# EAGLE schematic Arduino101 (EAGLE 7.7.0)

## Sheet 1 of 5: COVER PAGE -Table Of Contents
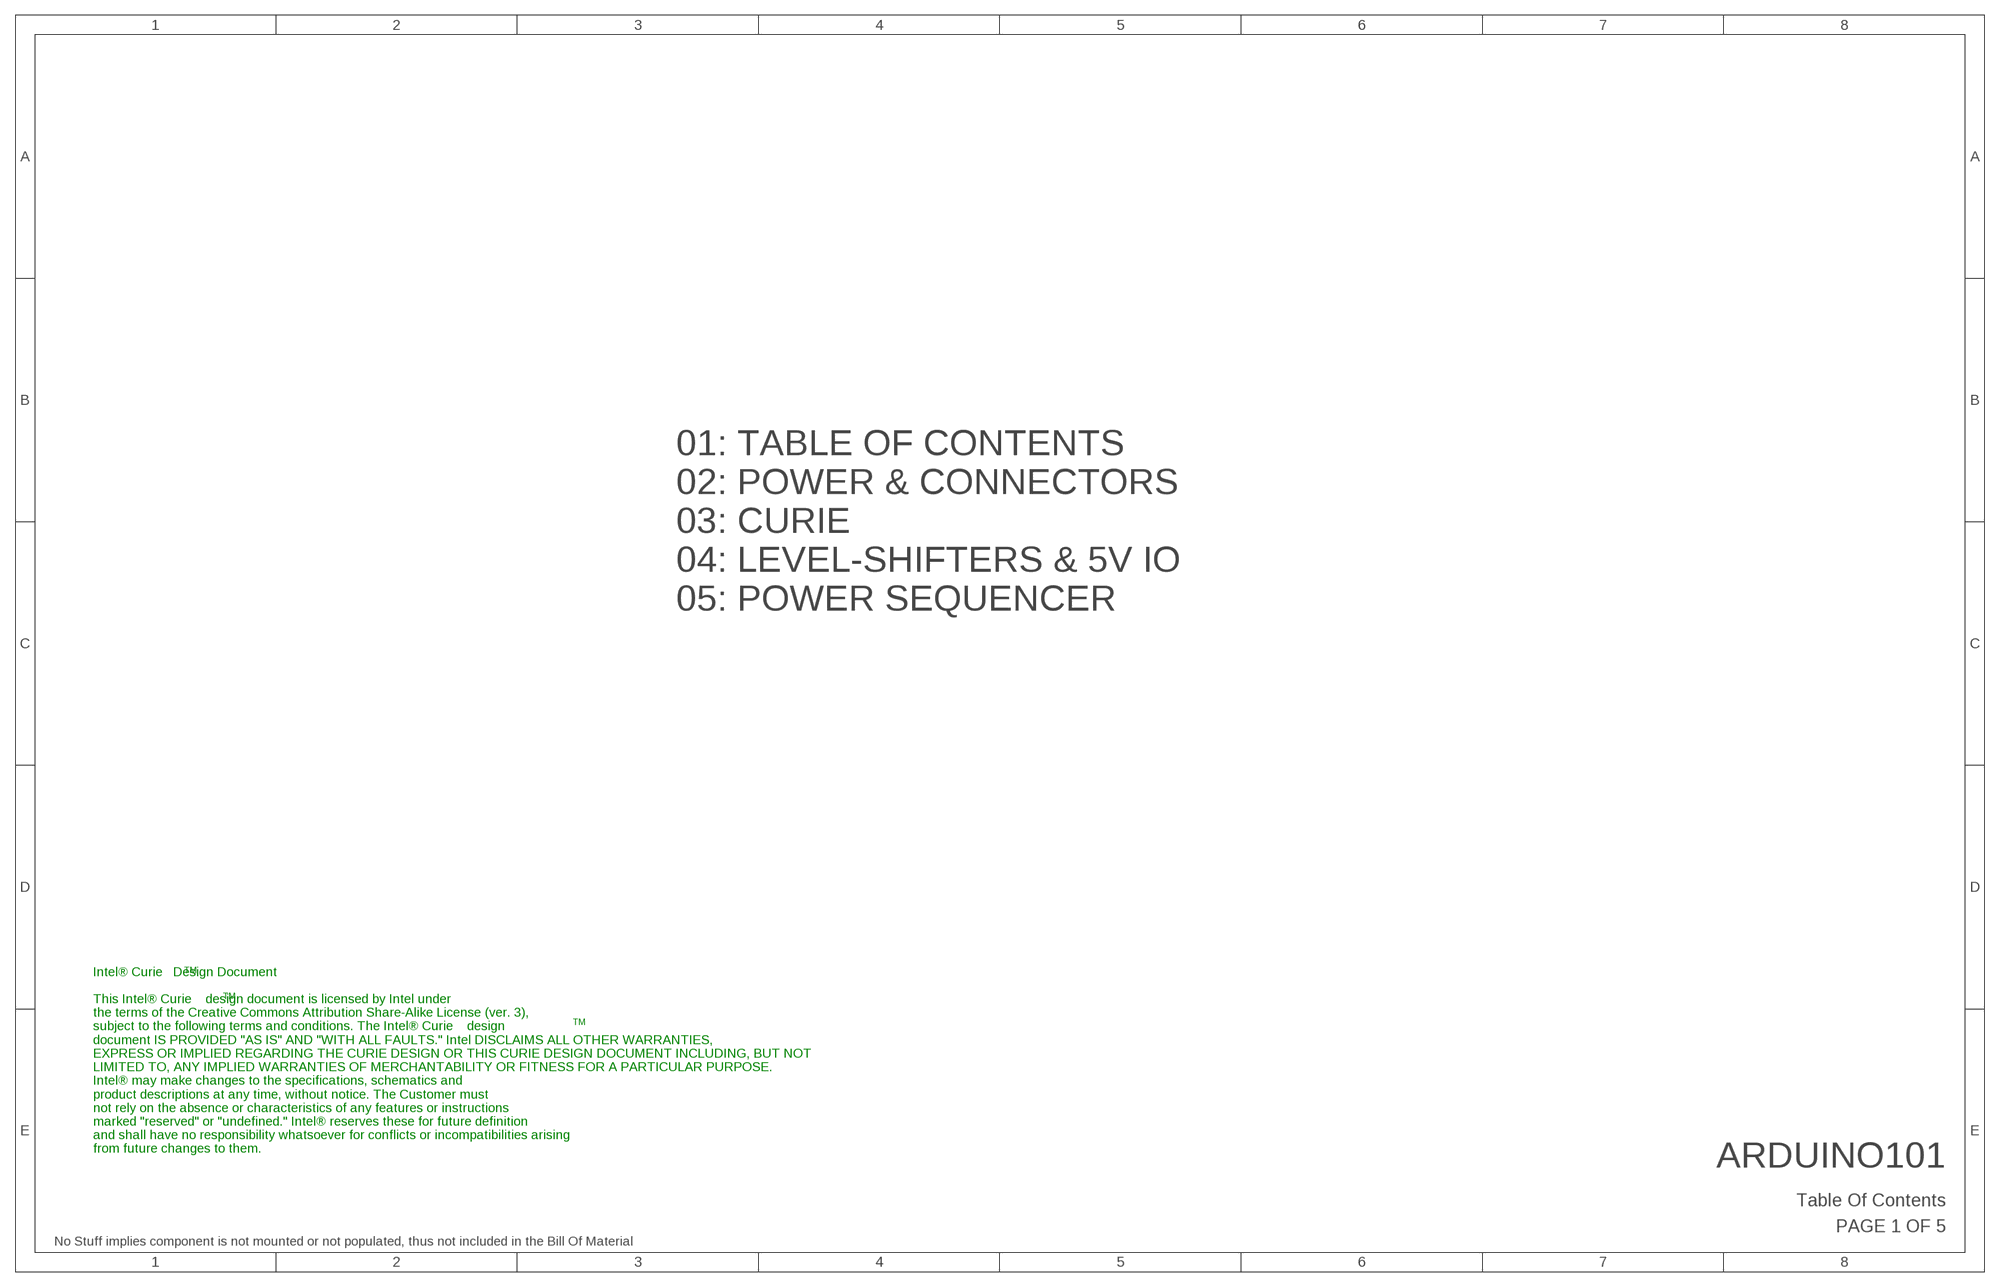
[diagram p0: schematic, sheet 1]

### Notes on the sheet
- 01: TABLE OF CONTENTS
- 02: POWER & CONNECTORS
- 03: CURIE
- 04: LEVEL-SHIFTERS & 5V IO
- 05: POWER SEQUENCER
- TM
- TM
- TM
- ARDUINO101
- Intel® Curie   Design Document
  
  This Intel® Curie    design document is licensed by Intel under
  the terms of the Creative Commons Attribution Share-Alike License (ver. 3),
  subject to the following terms and conditions. The Intel® Curie    design 
  document IS PROVIDED "AS IS" AND "WITH ALL FAULTS." Intel DISCLAIMS ALL OTHER WARRANTIES, 
  EXPRESS OR IMPLIED REGARDING THE CURIE DESIGN OR THIS CURIE DESIGN DOCUMENT INCLUDING, BUT NOT 
  LIMITED TO, ANY IMPLIED WARRANTIES OF MERCHANTABILITY OR FITNESS FOR A PARTICULAR PURPOSE.
  Intel® may make changes to the specifications, schematics and 
  product descriptions at any time, without notice. The Customer must 
  not rely on the absence or characteristics of any features or instructions 
  marked "reserved" or "undefined." Intel® reserves these for future definition 
  and shall have no responsibility whatsoever for conflicts or incompatibilities arising 
  from future changes to them.
- Table Of Contents
- PAGE 1 OF 5
- No Stuff implies component is not mounted or not populated, thus not included in the Bill Of Material

## Sheet 2 of 5: POWER & CONNECTORS
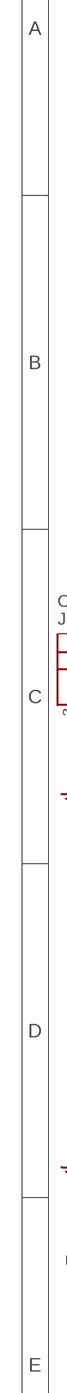
[diagram p1: schematic, sheet 2, part 1 of 2]
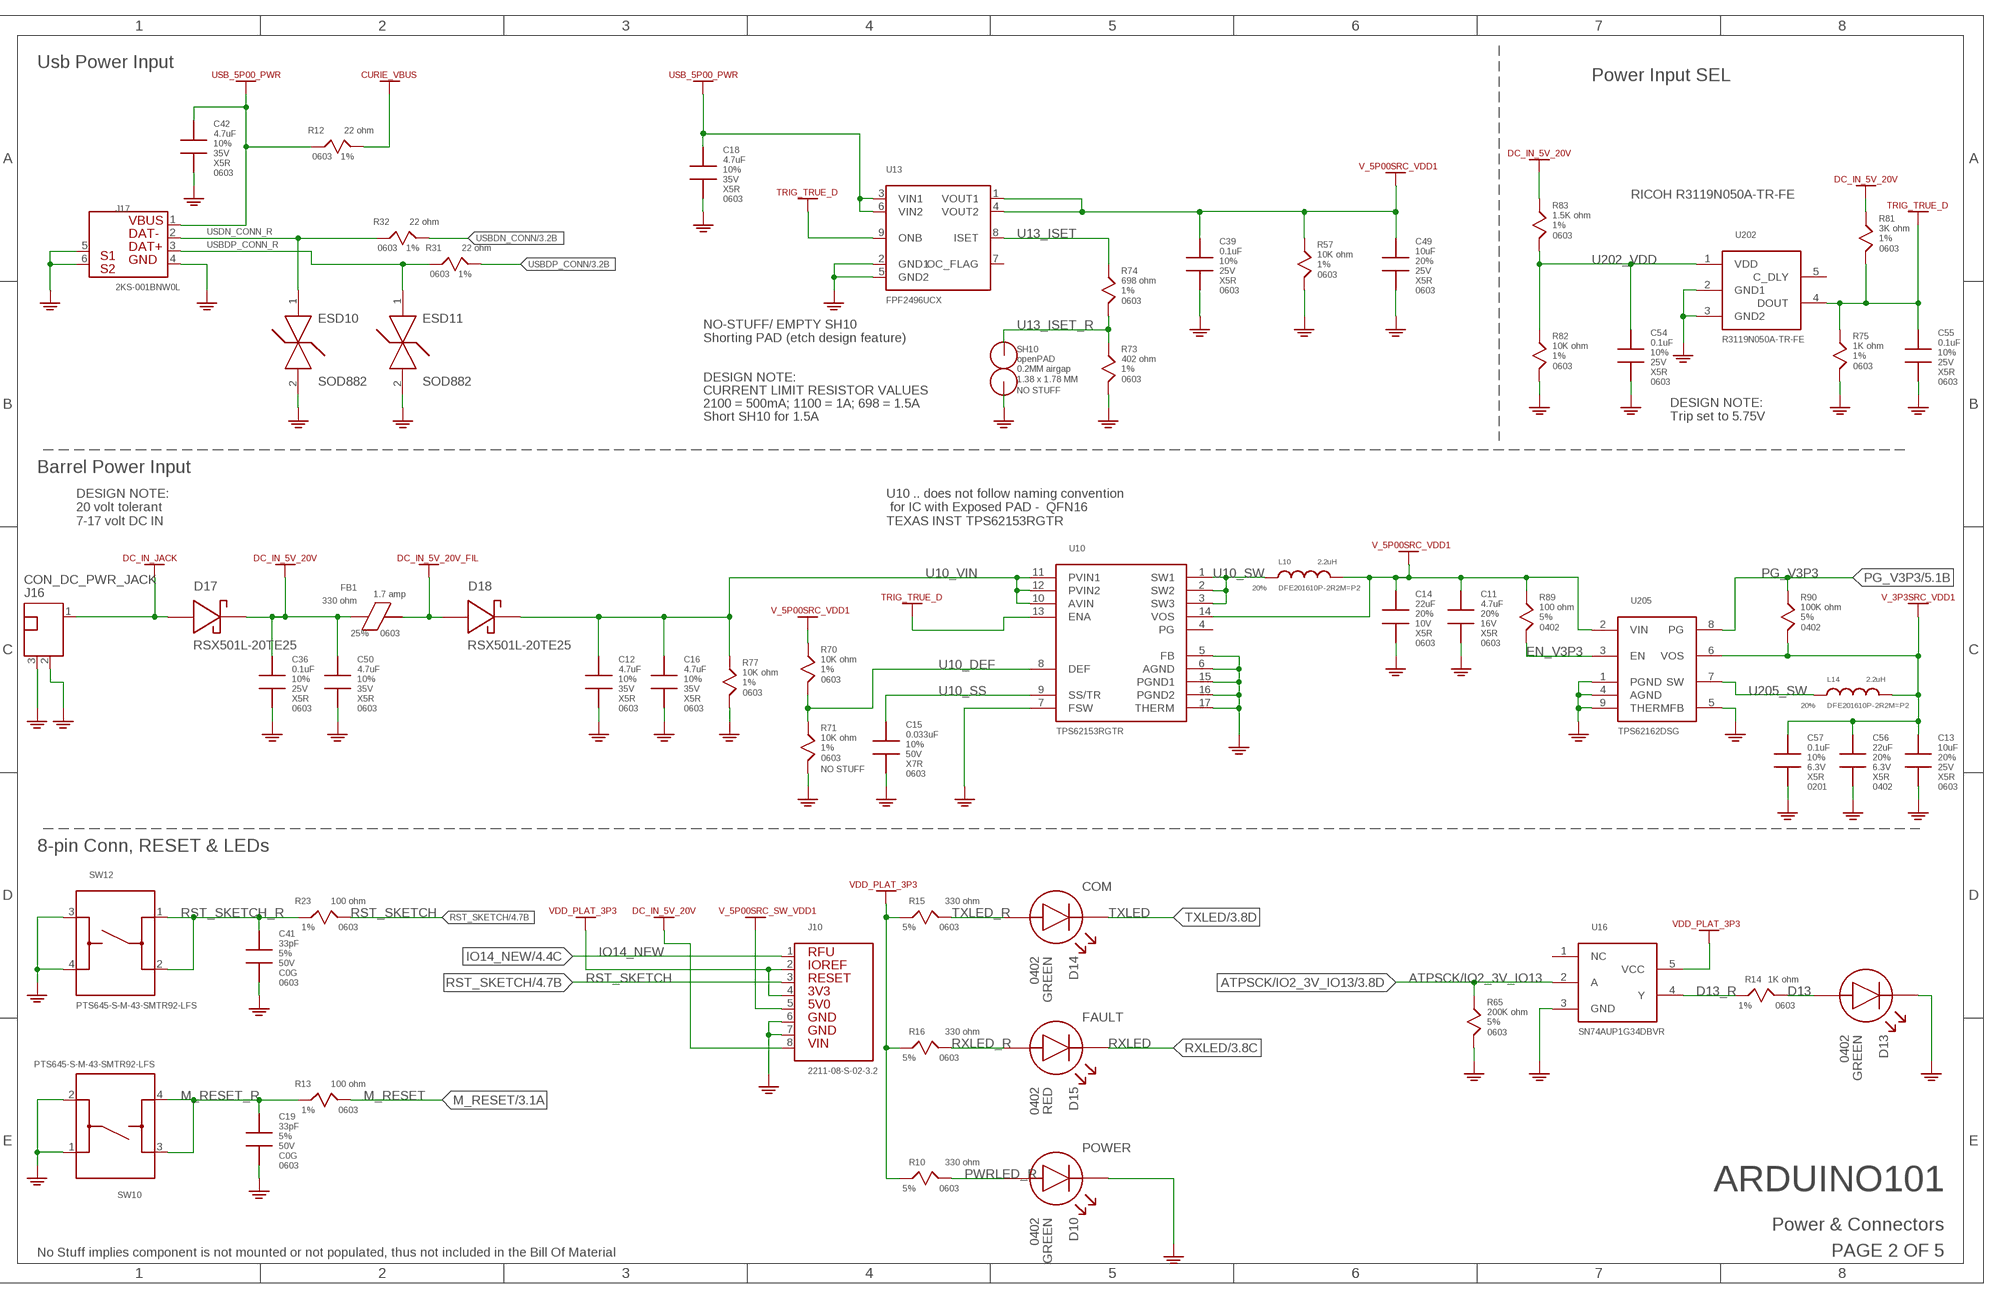
[diagram p2: schematic, sheet 2, part 2 of 2]

### Parts
C11  4.7uF  GRM188R61C475KAAJD  [0603X90H]
C12  4.7uF  GRM188R6YA475KE15D  [0603X90H]
C13  10uF  GRM188R61E106MA73D  [0603X90H]
C14  22uF  GRM188R61A226ME15D  [0603X90H]
C15  0.033uF  GRM188R71H333KA61F  [0603X90H]
C16  4.7uF  GRM188R6YA475KE15D  [0603X90H]
C18  4.7uF  GRM188R6YA475KE15D  [0603X90H]
C19  33pF  GRM1885C1H330JA01F  [0603X90H]
C36  0.1uF  GRM188R61E104KA01  [0603X90H]
C39  0.1uF  GRM188R61E104KA01  [0603X90H]
C41  33pF  GRM1885C1H330JA01F  [0603X90H]
C42  4.7uF  GRM188R6YA475KE15D  [0603X90H]
C49  10uF  GRM188R61E106MA73D  [0603X90H]
C50  4.7uF  GRM188R6YA475KE15D  [0603X90H]
C54  0.1uF  GRM188R61E104KA01  [0603X90H]
C55  0.1uF  GRM188R61E104KA01  [0603X90H]
C56  22uF  GRM155R60J226ME11D  [CAP0402]
C57  0.1uF  GRM033R60J104KE81D  [CAP0201]
D10  LED_SML-P12PTT86  [LED_100X60X25H_SMLP13]
D13  LED_SML-P12PTT86  [LED_100X60X25H_SMLP13]
D14  LED_SML-P12PTT86  [LED_100X60X25H_SMLP13]
D15  LED_SML-P11UTT86  [LED_100X60X25H_SMLP13]
D17  DIO_RSX501L-20TE25  [DIO2_450X260X220H]
D18  DIO_RSX501L-20TE25  [DIO2_450X260X220H]
ESD10  PESD5V0X1BCAL,315  [DIO_SOD882]
ESD11  PESD5V0X1BCAL,315  [DIO_SOD882]
FB1  FERRITE_BEAD_0603_BLM18KG331SN1D  [0603X90H]
J10  CON_1X8_2211-08-S-02-3.2  [CONF1X8-254P_2104X240X850H_TH]
J16  CON_DC_PWR_JACK  [CON_JACK_880X1350X1135H_EJ508A]
J17  CON_USB_TYPE_B  [CON_USB_1204X1650X1115_AUY1007]
L10  2.2uH  IND_DFE201610P-2R2M=P2  [0806X100H]
L14  2.2uH  IND_DFE201610P-2R2M=P2  [0806X100H]
R10  330 ohm  RK73B1JTTD331J  [0603X90H]
R12  22 ohm  CRCW060322R0FKEA  [0603X90H]
R13  100 ohm  RK73H1JTTD1000F  [0603X90H]
R14  1K ohm  RK73H1JTTD1001F  [0603X90H]
R15  330 ohm  RK73B1JTTD331J  [0603X90H]
R16  330 ohm  RK73B1JTTD331J  [0603X90H]
R23  100 ohm  RK73H1JTTD1000F  [0603X90H]
R31  22 ohm  CRCW060322R0FKEA  [0603X90H]
R32  22 ohm  CRCW060322R0FKEA  [0603X90H]
R57  10K ohm  CRCW060310K0FKEA  [0603X90H]
R65  200K ohm  CRCW0603200KJNEB  [0603X90H]
R70  10K ohm  CRCW060310K0FKEA  [0603X90H]
R71  10K ohm  CRCW060310K0FKEA_NOSTUFF  [0603X90H]
R73  402 ohm  CRCW0603402RFKEB  [0603X90H]
R74  698 ohm  CRCW0603698RFKEB  [0603X90H]
R75  1K ohm  RK73H1JTTD1001F  [0603X90H]
R77  10K ohm  CRCW060310K0FKEA  [0603X90H]
R81  3K ohm  RK73H1JTTD3001F  [0603X90H]
R82  10K ohm  CRCW060310K0FKEA  [0603X90H]
R83  1.5K ohm  CRCW06031K50FKEB  [0603X90H]
R89  100 ohm  CRCW0402100RJNED  [SMR0402]
R90  100K ohm  RK73B1ETTP104J  [SMR0402]
SH10  openPAD  SHORTING_PAD_2_SHORT_140X180_SH  [SHORT_140X180]
SW10  SWITCH_PTS645-S-M-43-SMTR92-LFS  [SW4_600X600X430H_SM_PTS645]
SW12  SWITCH_PTS645-S-M-43-SMTR92-LFS  [SW4_600X600X430H_SM_PTS645]
U10  TPS62153RGTR  [QFN16-50P_300X300X100H_TR]
U13  FPF2496UCX_WLCSP_VREG  [BGA9_3X3-40P_121X121X63H]
U16  SN74AUP1G34DBVR  [SOT23-5_160X290X145H]
U202  R3119-VREG  [SOT23-5_160X290X120H]
U205  TPS62162DSG  [USON8_5MM_2X2MM-DIE]

### Nets
ATPSCK/IO2_3V_IO13: R65.1 U16.2(A) ; also sheet 3,4
CURIE_VBUS: R12.2 ; also sheet 3
D13: D13.1(A) R14.2
D13_R: R14.1 U16.4(Y)
DC_IN_5V_20V: C36.1 C50.1 D17.1 FB1.1 J10.8 R81.1 R83.1
DC_IN_5V_20V_FIL: D18.2 FB1.2
DC_IN_JACK: D17.2 J16.1 ; also sheet 5
EN_V3P3 [PWR]: R89.2 U205.3(EN)
GND [PWR]: C11.2 C12.2 C13.2 C14.2 C15.2 C16.2 C18.2 C19.2 C36.2 C39.2 C41.2 C42.2 C49.2 C50.2 C54.2 C55.2 C56.2 C57.2 D10.2(K) D13.2(K) ESD10.2 ESD11.2 J10.6 J10.7 J16.2 J16.3 J17.4 J17.5 J17.6 R57.2 R65.2 R71.2 R73.2 R75.2 R77.2 R82.2 SH10.2 SW10.1 SW10.2 SW12.3 SW12.4 U10.5(FB) U10.6(AGND) U10.7(FSW) U10.15(PGND1) U10.16(PGND2) U10.17(THERM) U13.2(GND1) U13.5(GND2) U16.3(GND) U202.2(GND1) U202.3(GND2) U205.1(PGND) U205.4(AGND) U205.5(FB) U205.9(THERM) ; also sheet 3,4,5
IO14_NEW: J10.1 ; also sheet 4
M_RESET: R13.2 ; also sheet 3
M_RESET_R: C19.1 R13.1 SW10.3 SW10.4
PG_V3P3: R90.1 U205.8(PG) ; also sheet 5
PWRLED_R: D10.1(A) R10.2
RST_SKETCH: J10.3 R23.2 ; also sheet 4
RST_SKETCH_R: C41.1 R23.1 SW12.1 SW12.2
RXLED: D15.2(K) ; also sheet 3
RXLED_R: D15.1(A) R16.2
TRIG_TRUE_D: C55.1 R75.1 R81.2 U10.13(ENA) U13.9(ONB) U202.4(DOUT)
TXLED: D14.2(K) ; also sheet 3
TXLED_R: D14.1(A) R15.2
U10_DEF: R70.2 R71.1 U10.8(DEF)
U10_SS: C15.1 U10.9(SS/TR)
U10_SW: L10.1 U10.1(SW1) U10.2(SW2) U10.3(SW3)
U10_VIN: C12.1 C16.1 D18.1 R77.1 U10.10(AVIN) U10.11(PVIN1) U10.12(PVIN2)
U13_ISET: R74.1 U13.8(ISET)
U13_ISET_R: R73.1 R74.2 SH10.1
U202_VDD: C54.1 R82.1 R83.2 U202.1(VDD)
U205_SW: L14.1 U205.7(SW)
USB_5P00_PWR [PWR]: C18.1 C42.1 J17.1 R12.1 U13.3(VIN1) U13.6(VIN2) ; also sheet 5
USBDN_CONN [DIFF100]: R32.2 ; also sheet 3,5
USBDP_CONN: R31.2 ; also sheet 3,5
USBDP_CONN_R [DIFF100]: ESD11.1 J17.3 R31.1
USDN_CONN_R [DIFF100]: ESD10.1 J17.2 R32.1
V_3P3SRC_VDD1 [PWR]: C13.1 C56.1 C57.1 L14.2 R90.2 U205.6(VOS) ; also sheet 5
V_5P00SRC_SW_VDD1: J10.5 ; also sheet 4,5
V_5P00SRC_VDD1 [PWR]: C11.1 C14.1 C39.1 C49.1 L10.2 R57.1 R70.1 R89.1 U10.14(VOS) U13.1(VOUT1) U13.4(VOUT2) U205.2(VIN) ; also sheet 5
VDD_PLAT_3P3 [PWR]: J10.2 J10.4 R10.1 R15.1 R16.1 U16.5(VCC) ; also sheet 3,4,5
Unconnected: U10.4(PG) U13.7(OC_FLAG) U16.1(NC) U202.5(C_DLY)

### Notes on the sheet
- Usb Power Input
- Power Input SEL
- RICOH R3119N050A-TR-FE
- NO-STUFF/ EMPTY SH10
  Shorting PAD (etch design feature)
- DESIGN NOTE:
- CURRENT LIMIT RESISTOR VALUES
- 2100 = 500mA; 1100 = 1A; 698 = 1.5A
- Short SH10 for 1.5A
- DESIGN NOTE:
  Trip set to 5.75V
- Barrel Power Input
- DESIGN NOTE:
  20 volt tolerant
  7-17 volt DC IN
- U10 .. does not follow naming convention
   for IC with Exposed PAD -  QFN16 
  TEXAS INST TPS62153RGTR
- 8-pin Conn, RESET & LEDs
- COM
- FAULT
- POWER
- ARDUINO101
- Power & Connectors
- PAGE 2 OF 5
- No Stuff implies component is not mounted or not populated, thus not included in the Bill Of Material

## Sheet 3 of 5: Curie
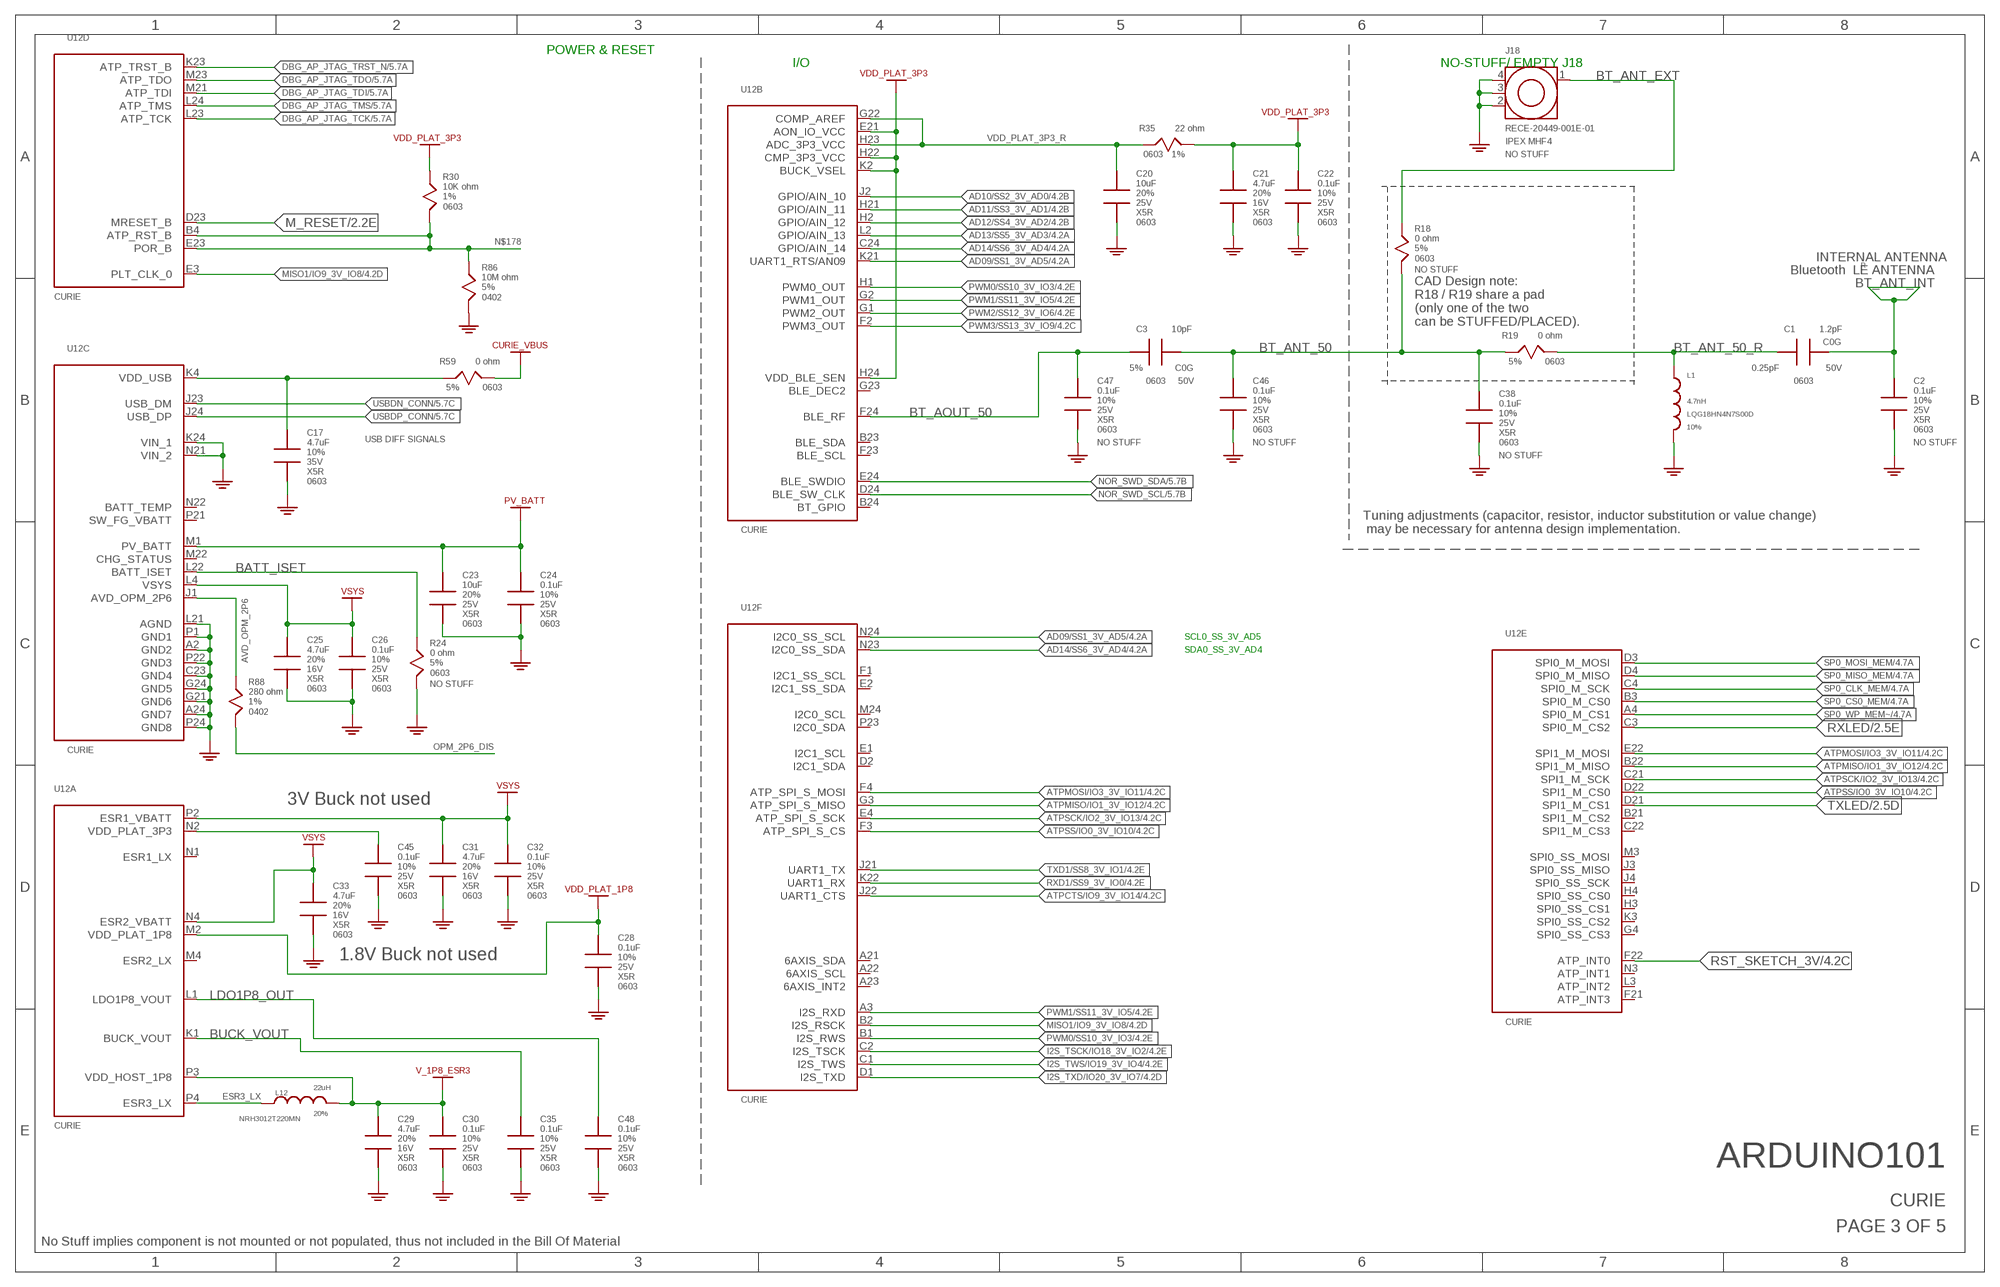
[diagram p3: schematic, sheet 3]

### Parts
C1  1.2pF  CC0603CRNPO9BN1R2  [0603X90H]
C2  0.1uF  GRM188R61E104KA01_NOSTUFF  [0603X90H]
C3  10pF  GRM1885C1H100JA01F  [0603X90H]
C17  4.7uF  GRM188R6YA475KE15D  [0603X90H]
C20  10uF  GRM188R61E106MA73D  [0603X90H]
C21  4.7uF  GRM188R61C475KAAJD  [0603X90H]
C22  0.1uF  GRM188R61E104KA01  [0603X90H]
C23  10uF  GRM188R61E106MA73D  [0603X90H]
C24  0.1uF  GRM188R61E104KA01  [0603X90H]
C25  4.7uF  GRM188R61C475KAAJD  [0603X90H]
C26  0.1uF  GRM188R61E104KA01  [0603X90H]
C28  0.1uF  GRM188R61E104KA01  [0603X90H]
C29  4.7uF  GRM188R61C475KAAJD  [0603X90H]
C30  0.1uF  GRM188R61E104KA01  [0603X90H]
C31  4.7uF  GRM188R61C475KAAJD  [0603X90H]
C32  0.1uF  GRM188R61E104KA01  [0603X90H]
C33  4.7uF  GRM188R61C475KAAJD  [0603X90H]
C35  0.1uF  GRM188R61E104KA01  [0603X90H]
C38  0.1uF  GRM188R61E104KA01_NOSTUFF  [0603X90H]
C45  0.1uF  GRM188R61E104KA01  [0603X90H]
C46  0.1uF  GRM188R61E104KA01_NOSTUFF  [0603X90H]
C47  0.1uF  GRM188R61E104KA01_NOSTUFF  [0603X90H]
C48  0.1uF  GRM188R61E104KA01  [0603X90H]
J18  20449-001E-01  [CONN_COAX_MHF4]
L1  4.7nH  IND_LQG18HN4N7S00D  [0603X90H]
L12  22uH  NRH3012T220MN  [COIL_300X300X120H_NRH3012]
R18  0 ohm  CRCW06030000Z0EA_NOSTUFF  [0603X90H]
R19  0 ohm  CRCW06030000Z0EA  [0603X90H]
R24  0 ohm  CRCW06030000Z0EA_NOSTUFF  [0603X90H]
R30  10K ohm  CRCW060310K0FKEA  [0603X90H]
R35  22 ohm  CRCW060322R0FKEA  [0603X90H]
R59  0 ohm  CRCW06030000Z0EA  [0603X90H]
R86  10M ohm  RK73B1ETTP106J  [SMR0402]
R88  280 ohm  RK73H1ETTP2800F  [SMR0402]
U12  CURIE  [BGA111_14X24-57P_805X1100X150H]

### Nets
AD09/SS1_3V_AD5: U12.K21(B:UART1_RTS/AN09) U12.N24(F:I2C0_SS_SCL) ; also sheet 4
AD10/SS2_3V_AD0: U12.J2(B:GPIO/AIN_10) ; also sheet 4
AD11/SS3_3V_AD1: U12.H21(B:GPIO/AIN_11) ; also sheet 4
AD12/SS4_3V_AD2: U12.H2(B:GPIO/AIN_12) ; also sheet 4
AD13/SS5_3V_AD3: U12.L2(B:GPIO/AIN_13) ; also sheet 4
AD14/SS6_3V_AD4: U12.C24(B:GPIO/AIN_14) U12.N23(F:I2C0_SS_SDA) ; also sheet 4
ATPCTS/IO9_3V_IO14: U12.J22(F:UART1_CTS) ; also sheet 4
ATPMISO/IO1_3V_IO12: U12.B22(E:SPI1_M_MISO) U12.G3(F:ATP_SPI_S_MISO) ; also sheet 4
ATPMOSI/IO3_3V_IO11: U12.E22(E:SPI1_M_MOSI) U12.F4(F:ATP_SPI_S_MOSI) ; also sheet 4
ATPSCK/IO2_3V_IO13: U12.C21(E:SPI1_M_SCK) U12.E4(F:ATP_SPI_S_SCK) ; also sheet 2,4
ATPSS/IO0_3V_IO10: U12.D22(E:SPI1_M_CS0) U12.F3(F:ATP_SPI_S_CS) ; also sheet 4
AVD_OPM_2P6: R88.1 U12.J1(C:AVD_OPM_2P6)
BATT_ISET: R24.1 U12.L22(C:BATT_ISET)
BT_ANT_50 [RF]: C3.2 C38.1 C46.1 R18.2 R19.1
BT_ANT_50_R: C1.1 L1.1 R19.2
BT_ANT_EXT [RF]: J18.1 R18.1
BT_ANT_INT [PWR]: C1.2 C2.1
BT_AOUT_50: C3.1 C47.1 U12.F24(B:BLE_RF)
BUCK_VOUT: C35.1 U12.K1(A:BUCK_VOUT)
CURIE_VBUS: R59.2 ; also sheet 2
DBG_AP_JTAG_TCK: U12.L23(D:ATP_TCK) ; also sheet 5
DBG_AP_JTAG_TDI: U12.M21(D:ATP_TDI) ; also sheet 5
DBG_AP_JTAG_TDO: U12.M23(D:ATP_TDO) ; also sheet 5
DBG_AP_JTAG_TMS: U12.L24(D:ATP_TMS) ; also sheet 5
DBG_AP_JTAG_TRST_N: U12.K23(D:ATP_TRST_B) ; also sheet 5
ESR3_LX: L12.1 U12.P4(A:ESR3_LX)
GND [PWR]: C2.2 C17.2 C20.2 C21.2 C22.2 C23.2 C24.2 C25.2 C26.2 C28.2 C29.2 C30.2 C31.2 C32.2 C33.2 C35.2 C38.2 C45.2 C46.2 C47.2 C48.2 J18.2 J18.3 J18.4 L1.2 R24.2 R86.2 U12.A2(C:GND2) U12.A24(C:GND7) U12.C23(C:GND4) U12.G21(C:GND6) U12.G24(C:GND5) U12.K24(C:VIN_1) U12.L21(C:AGND) U12.N21(C:VIN_2) U12.P1(C:GND1) U12.P22(C:GND3) U12.P24(C:GND8) ; also sheet 2,4,5
I2S_TSCK/IO18_3V_IO2: U12.C2(F:I2S_TSCK) ; also sheet 4
I2S_TWS/IO19_3V_IO4: U12.C1(F:I2S_TWS) ; also sheet 4
I2S_TXD/IO20_3V_IO7: U12.D1(F:I2S_TXD) ; also sheet 4
LDO1P8_OUT: C48.1 U12.L1(A:LDO1P8_VOUT)
M_RESET: U12.D23(D:MRESET_B) ; also sheet 2
MISO1/IO9_3V_IO8: U12.B2(F:I2S_RSCK) U12.E3(D:PLT_CLK_0) ; also sheet 4
N$1: C17.1 R59.1 U12.K4(C:VDD_USB)
N$8: C45.1 U12.N2(A:VDD_PLAT_3P3)
N$178: R30.2 R86.1 U12.B4(D:ATP_RST_B) U12.E23(D:POR_B) ; also sheet 5
NOR_SWD_SCL: U12.D24(B:BLE_SW_CLK) ; also sheet 5
NOR_SWD_SDA: U12.E24(B:BLE_SWDIO) ; also sheet 5
OPM_2P6_DIS: R88.2 ; also sheet 5
PV_BATT [PWR]: C23.1 C24.1 U12.M1(C:PV_BATT)
PWM0/SS10_3V_IO3: U12.B1(F:I2S_RWS) U12.H1(B:PWM0_OUT) ; also sheet 4
PWM1/SS11_3V_IO5: U12.A3(F:I2S_RXD) U12.G2(B:PWM1_OUT) ; also sheet 4
PWM2/SS12_3V_IO6: U12.G1(B:PWM2_OUT) ; also sheet 4
PWM3/SS13_3V_IO9: U12.F2(B:PWM3_OUT) ; also sheet 4
RST_SKETCH_3V: U12.F22(E:ATP_INT0) ; also sheet 4
RXD1/SS9_3V_IO0: U12.K22(F:UART1_RX) ; also sheet 4
RXLED: U12.C3(E:SPI0_M_CS2) ; also sheet 2
SP0_CLK_MEM: U12.C4(E:SPI0_M_SCK) ; also sheet 4
SP0_CS0_MEM: U12.B3(E:SPI0_M_CS0) ; also sheet 4
SP0_MISO_MEM: U12.D4(E:SPI0_M_MISO) ; also sheet 4
SP0_MOSI_MEM: U12.D3(E:SPI0_M_MOSI) ; also sheet 4
SP0_WP_MEM~: U12.A4(E:SPI0_M_CS1) ; also sheet 4
TXD1/SS8_3V_IO1: U12.J21(F:UART1_TX) ; also sheet 4
TXLED: U12.D21(E:SPI1_M_CS1) ; also sheet 2
USBDN_CONN [DIFF100]: U12.J23(C:USB_DM) ; also sheet 2,5
USBDP_CONN: U12.J24(C:USB_DP) ; also sheet 2,5
V_1P8_ESR3 [PWR]: C29.1 C30.1 L12.2 U12.P3(A:VDD_HOST_1P8)
VDD_PLAT_1P8 [PWR]: C28.1 U12.M2(A:VDD_PLAT_1P8)
VDD_PLAT_3P3 [PWR]: C21.1 C22.1 R30.1 R35.2 U12.E21(B:AON_IO_VCC) U12.H22(B:CMP_3P3_VCC) U12.H24(B:VDD_BLE_SEN) U12.K2(B:BUCK_VSEL) ; also sheet 2,4,5
VDD_PLAT_3P3_R: C20.1 R35.1 U12.G22(B:COMP_AREF) U12.H23(B:ADC_3P3_VCC)
VSYS [PWR]: C25.1 C26.1 C31.1 C32.1 C33.1 U12.L4(C:VSYS) U12.N4(A:ESR2_VBATT) U12.P2(A:ESR1_VBATT) ; also sheet 5
Unconnected: U12.A21(F:6AXIS_SDA) U12.A22(F:6AXIS_SCL) U12.A23(F:6AXIS_INT2) U12.B21(E:SPI1_M_CS2) U12.B23(B:BLE_SDA) U12.B24(B:BT_GPIO) U12.C22(E:SPI1_M_CS3) U12.D2(F:I2C1_SDA) U12.E1(F:I2C1_SCL) U12.E2(F:I2C1_SS_SDA) U12.F1(F:I2C1_SS_SCL) U12.F21(E:ATP_INT3) U12.F23(B:BLE_SCL) U12.G4(E:SPI0_SS_CS3) U12.G23(B:BLE_DEC2) U12.H3(E:SPI0_SS_CS1) U12.H4(E:SPI0_SS_CS0) U12.J3(E:SPI0_SS_MISO) U12.J4(E:SPI0_SS_SCK) U12.K3(E:SPI0_SS_CS2) U12.L3(E:ATP_INT2) U12.M3(E:SPI0_SS_MOSI) U12.M4(A:ESR2_LX) U12.M22(C:CHG_STATUS) U12.M24(F:I2C0_SCL) U12.N1(A:ESR1_LX) U12.N3(E:ATP_INT1) U12.N22(C:BATT_TEMP) U12.P21(C:SW_FG_VBATT) U12.P23(F:I2C0_SDA)

### Notes on the sheet
- POWER & RESET
- I/O | NO-STUFF/ EMPTY J18
- INTERNAL ANTENNA
- R
- Bluetooth  LE ANTENNA
- CAD Design note:
  R18 / R19 share a pad
  (only one of the two
  can be STUFFED/PLACED).
- USB DIFF SIGNALS
- Tuning adjustments (capacitor, resistor, inductor substitution or value change)
   may be necessary for antenna design implementation.
- SCL0_SS_3V_AD5
- SDA0_SS_3V_AD4
- 3V Buck not used
- 1.8V Buck not used
- ARDUINO101
- CURIE
- PAGE 3 OF 5
- No Stuff implies component is not mounted or not populated, thus not included in the Bill Of Material

## Sheet 4 of 5: LEVEL SHIFTERS & 5V IO
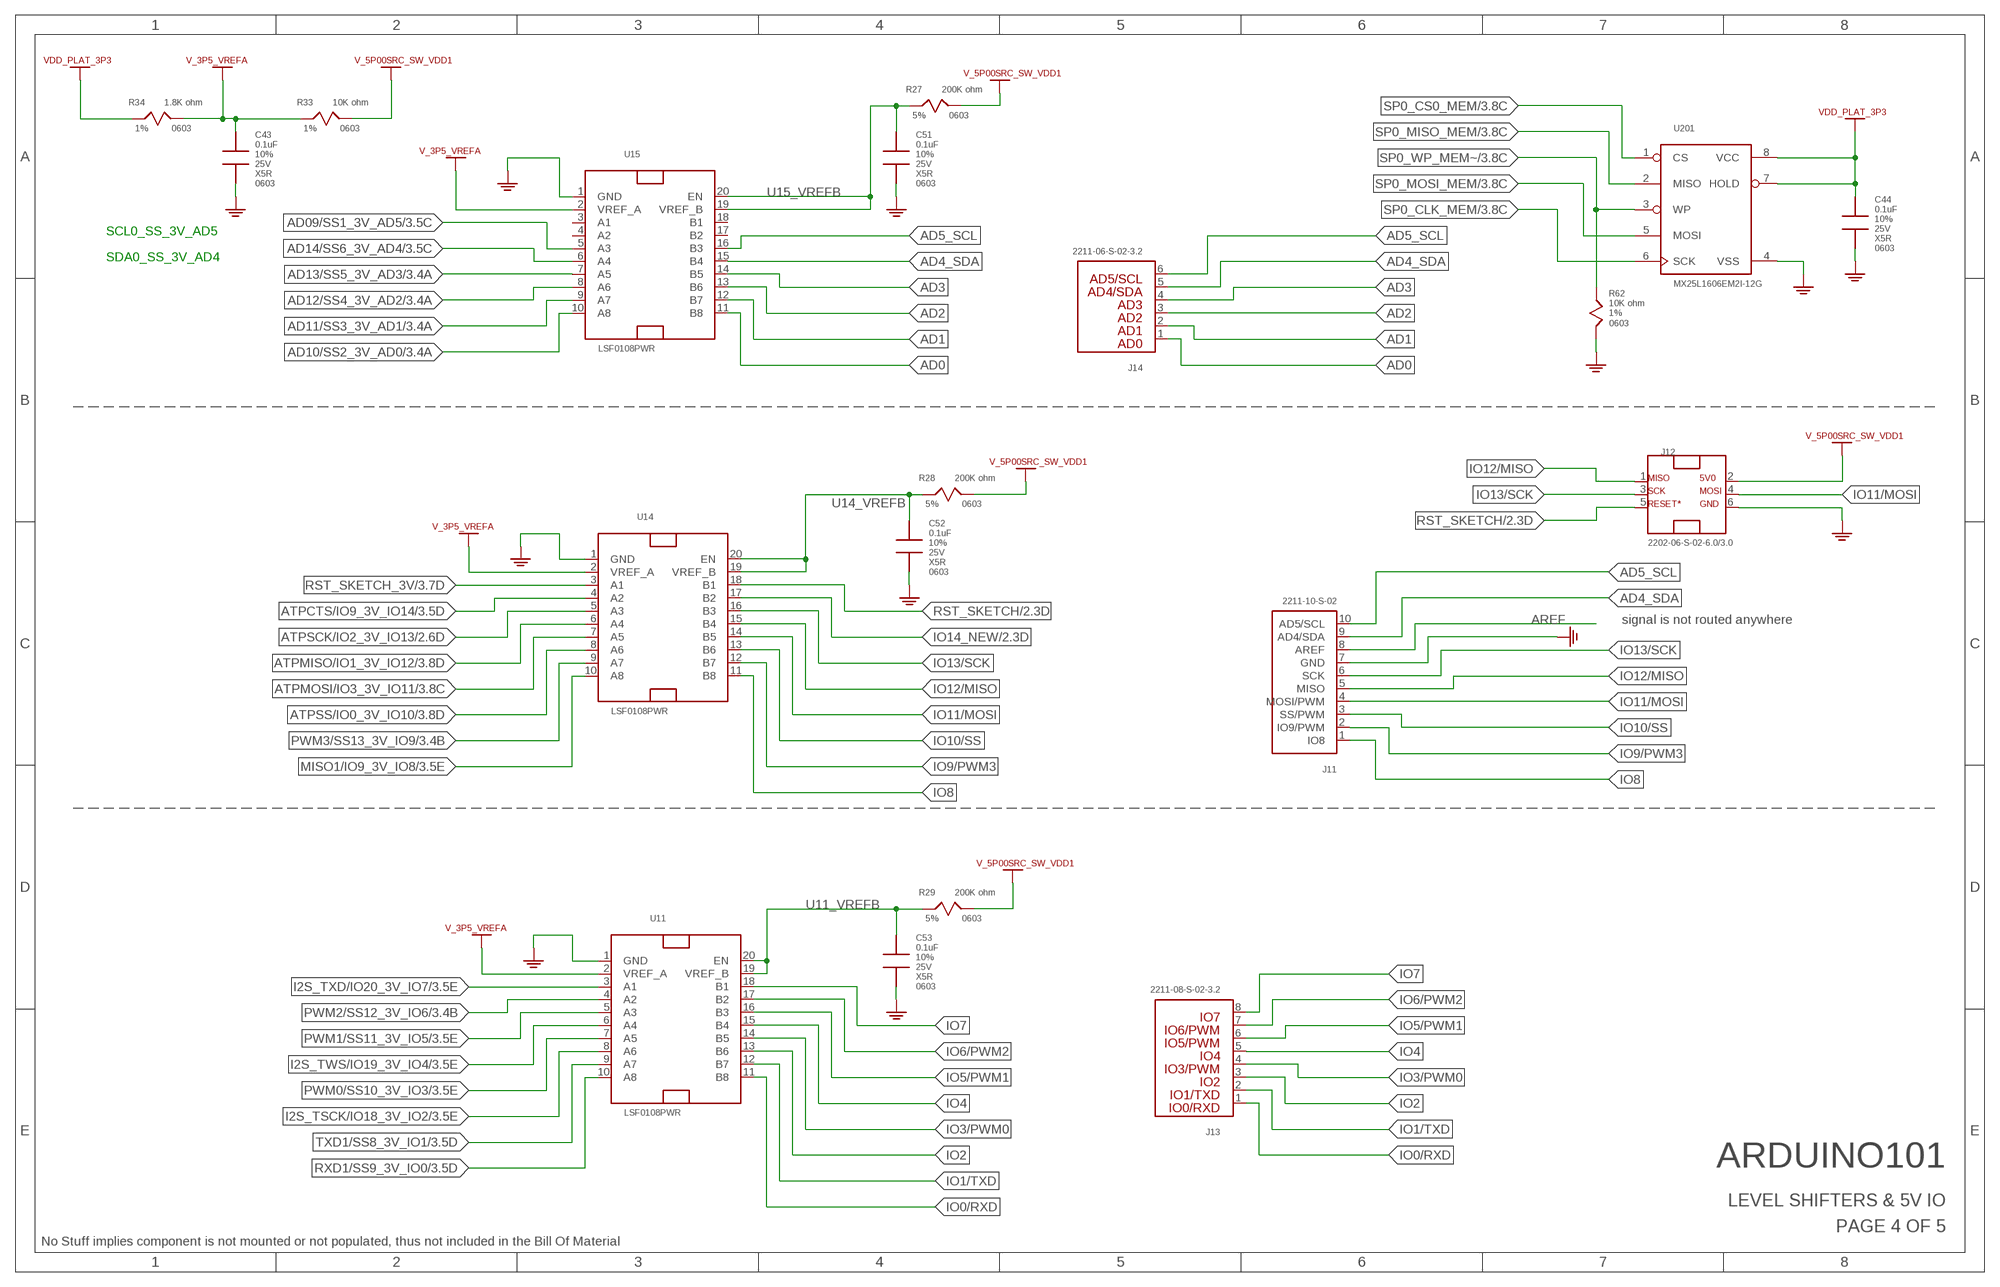
[diagram p4: schematic, sheet 4]

### Parts
C43  0.1uF  GRM188R61E104KA01  [0603X90H]
C44  0.1uF  GRM188R61E104KA01  [0603X90H]
C51  0.1uF  GRM188R61E104KA01  [0603X90H]
C52  0.1uF  GRM188R61E104KA01  [0603X90H]
C53  0.1uF  GRM188R61E104KA01  [0603X90H]
J11  CON_1X10_2211-10-S-02  [CONF1X10-254P_2612X240X850H_TH]
J12  CON_2X3_2202-06-S-02-6.0  [CONM2X3-254P_762X500X860H_TH]
J13  CON_1X8_2211-08-S-02-3.2_IO  [CONF1X8-254P_2104X240X850H_TH]
J14  CON_1X6_2211-06-S-02-3.2  [CONF1X6-254P_1596X240X850H_TH]
R27  200K ohm  CRCW0603200KJNEB  [0603X90H]
R28  200K ohm  CRCW0603200KJNEB  [0603X90H]
R29  200K ohm  CRCW0603200KJNEB  [0603X90H]
R33  10K ohm  CRCW060310K0FKEA  [0603X90H]
R34  1.8K ohm  CRCW06031K80FKEBC  [0603X90H]
R62  10K ohm  CRCW060310K0FKEA  [0603X90H]
U11  IC_LSF0108PWR  [SOIC20-65P_440X650X120H]
U14  IC_LSF0108PWR  [SOIC20-65P_440X650X120H]
U15  IC_LSF0108PWR  [SOIC20-65P_440X650X120H]
U201  IC_MX25V1635FM2I_FLASH  [SOIC8-127P_528X528X216H_1PRIMARY]

### Nets
AD0: J14.1 U15.11(B8)
AD1: J14.2 U15.12(B7)
AD2: J14.3 U15.13(B6)
AD3: J14.4 U15.14(B5)
AD4_SDA: J11.9(AD4/SDA) J14.5 U15.15(B4)
AD5_SCL: J11.10(AD5/SCL) J14.6 U15.16(B3)
AD09/SS1_3V_AD5: U15.5(A3) ; also sheet 3
AD10/SS2_3V_AD0: U15.10(A8) ; also sheet 3
AD11/SS3_3V_AD1: U15.9(A7) ; also sheet 3
AD12/SS4_3V_AD2: U15.8(A6) ; also sheet 3
AD13/SS5_3V_AD3: U15.7(A5) ; also sheet 3
AD14/SS6_3V_AD4: U15.6(A4) ; also sheet 3
AREF: J11.8(AREF)
ATPCTS/IO9_3V_IO14: U14.4(A2) ; also sheet 3
ATPMISO/IO1_3V_IO12: U14.6(A4) ; also sheet 3
ATPMOSI/IO3_3V_IO11: U14.7(A5) ; also sheet 3
ATPSCK/IO2_3V_IO13: U14.5(A3) ; also sheet 2,3
ATPSS/IO0_3V_IO10: U14.8(A6) ; also sheet 3
GND [PWR]: C43.2 C44.2 C51.2 C52.2 C53.2 J11.7(GND) J12.6 R62.2 U11.1(GND) U14.1(GND) U15.1(GND) U201.4(VSS) ; also sheet 2,3,5
I2S_TSCK/IO18_3V_IO2: U11.8(A6) ; also sheet 3
I2S_TWS/IO19_3V_IO4: U11.6(A4) ; also sheet 3
I2S_TXD/IO20_3V_IO7: U11.3(A1) ; also sheet 3
IO0/RXD: J13.1 U11.11(B8)
IO1/TXD: J13.2 U11.12(B7)
IO2: J13.3 U11.13(B6)
IO3/PWM0: J13.4 U11.14(B5)
IO4: J13.5 U11.15(B4)
IO5/PWM1: J13.6 U11.16(B3)
IO6/PWM2: J13.7 U11.17(B2)
IO7: J13.8 U11.18(B1)
IO8: J11.1(IO8) U14.11(B8)
IO9/PWM3: J11.2(IO9/PWM) U14.12(B7)
IO10/SS: J11.3(SS/PWM) U14.13(B6)
IO11/MOSI: J11.4(MOSI/PWM) J12.4 U14.14(B5)
IO12/MISO: J11.5(MISO) J12.1 U14.15(B4)
IO13/SCK: J11.6(SCK) J12.3 U14.16(B3)
IO14_NEW: U14.17(B2) ; also sheet 2
MISO1/IO9_3V_IO8: U14.10(A8) ; also sheet 3
PWM0/SS10_3V_IO3: U11.7(A5) ; also sheet 3
PWM1/SS11_3V_IO5: U11.5(A3) ; also sheet 3
PWM2/SS12_3V_IO6: U11.4(A2) ; also sheet 3
PWM3/SS13_3V_IO9: U14.9(A7) ; also sheet 3
RST_SKETCH: J12.5 U14.18(B1) ; also sheet 2
RST_SKETCH_3V: U14.3(A1) ; also sheet 3
RXD1/SS9_3V_IO0: U11.10(A8) ; also sheet 3
SP0_CLK_MEM: U201.6(SCK) ; also sheet 3
SP0_CS0_MEM: U201.1(CS) ; also sheet 3
SP0_MISO_MEM: U201.2(MISO) ; also sheet 3
SP0_MOSI_MEM: U201.5(MOSI) ; also sheet 3
SP0_WP_MEM~: R62.1 U201.3(WP) ; also sheet 3
TXD1/SS8_3V_IO1: U11.9(A7) ; also sheet 3
U11_VREFB: C53.1 R29.1 U11.19(VREF_B) U11.20(EN)
U14_VREFB: C52.1 R28.1 U14.19(VREF_B) U14.20(EN)
U15_VREFB: C51.1 R27.1 U15.19(VREF_B) U15.20(EN)
V_3P5_VREFA: C43.1 R33.1 R34.2 U11.2(VREF_A) U14.2(VREF_A) U15.2(VREF_A)
V_5P00SRC_SW_VDD1: J12.2 R27.2 R28.2 R29.2 R33.2 ; also sheet 2,5
VDD_PLAT_3P3 [PWR]: C44.1 R34.1 U201.7(HOLD) U201.8(VCC) ; also sheet 2,3,5
Unconnected: U15.3(A1) U15.4(A2) U15.17(B2) U15.18(B1)

### Notes on the sheet
- SCL0_SS_3V_AD5
- SDA0_SS_3V_AD4
- signal is not routed anywhere
- ARDUINO101
- LEVEL SHIFTERS & 5V IO
- PAGE 4 OF 5
- No Stuff implies component is not mounted or not populated, thus not included in the Bill Of Material

## Sheet 5 of 5: POWER SEQUENCER
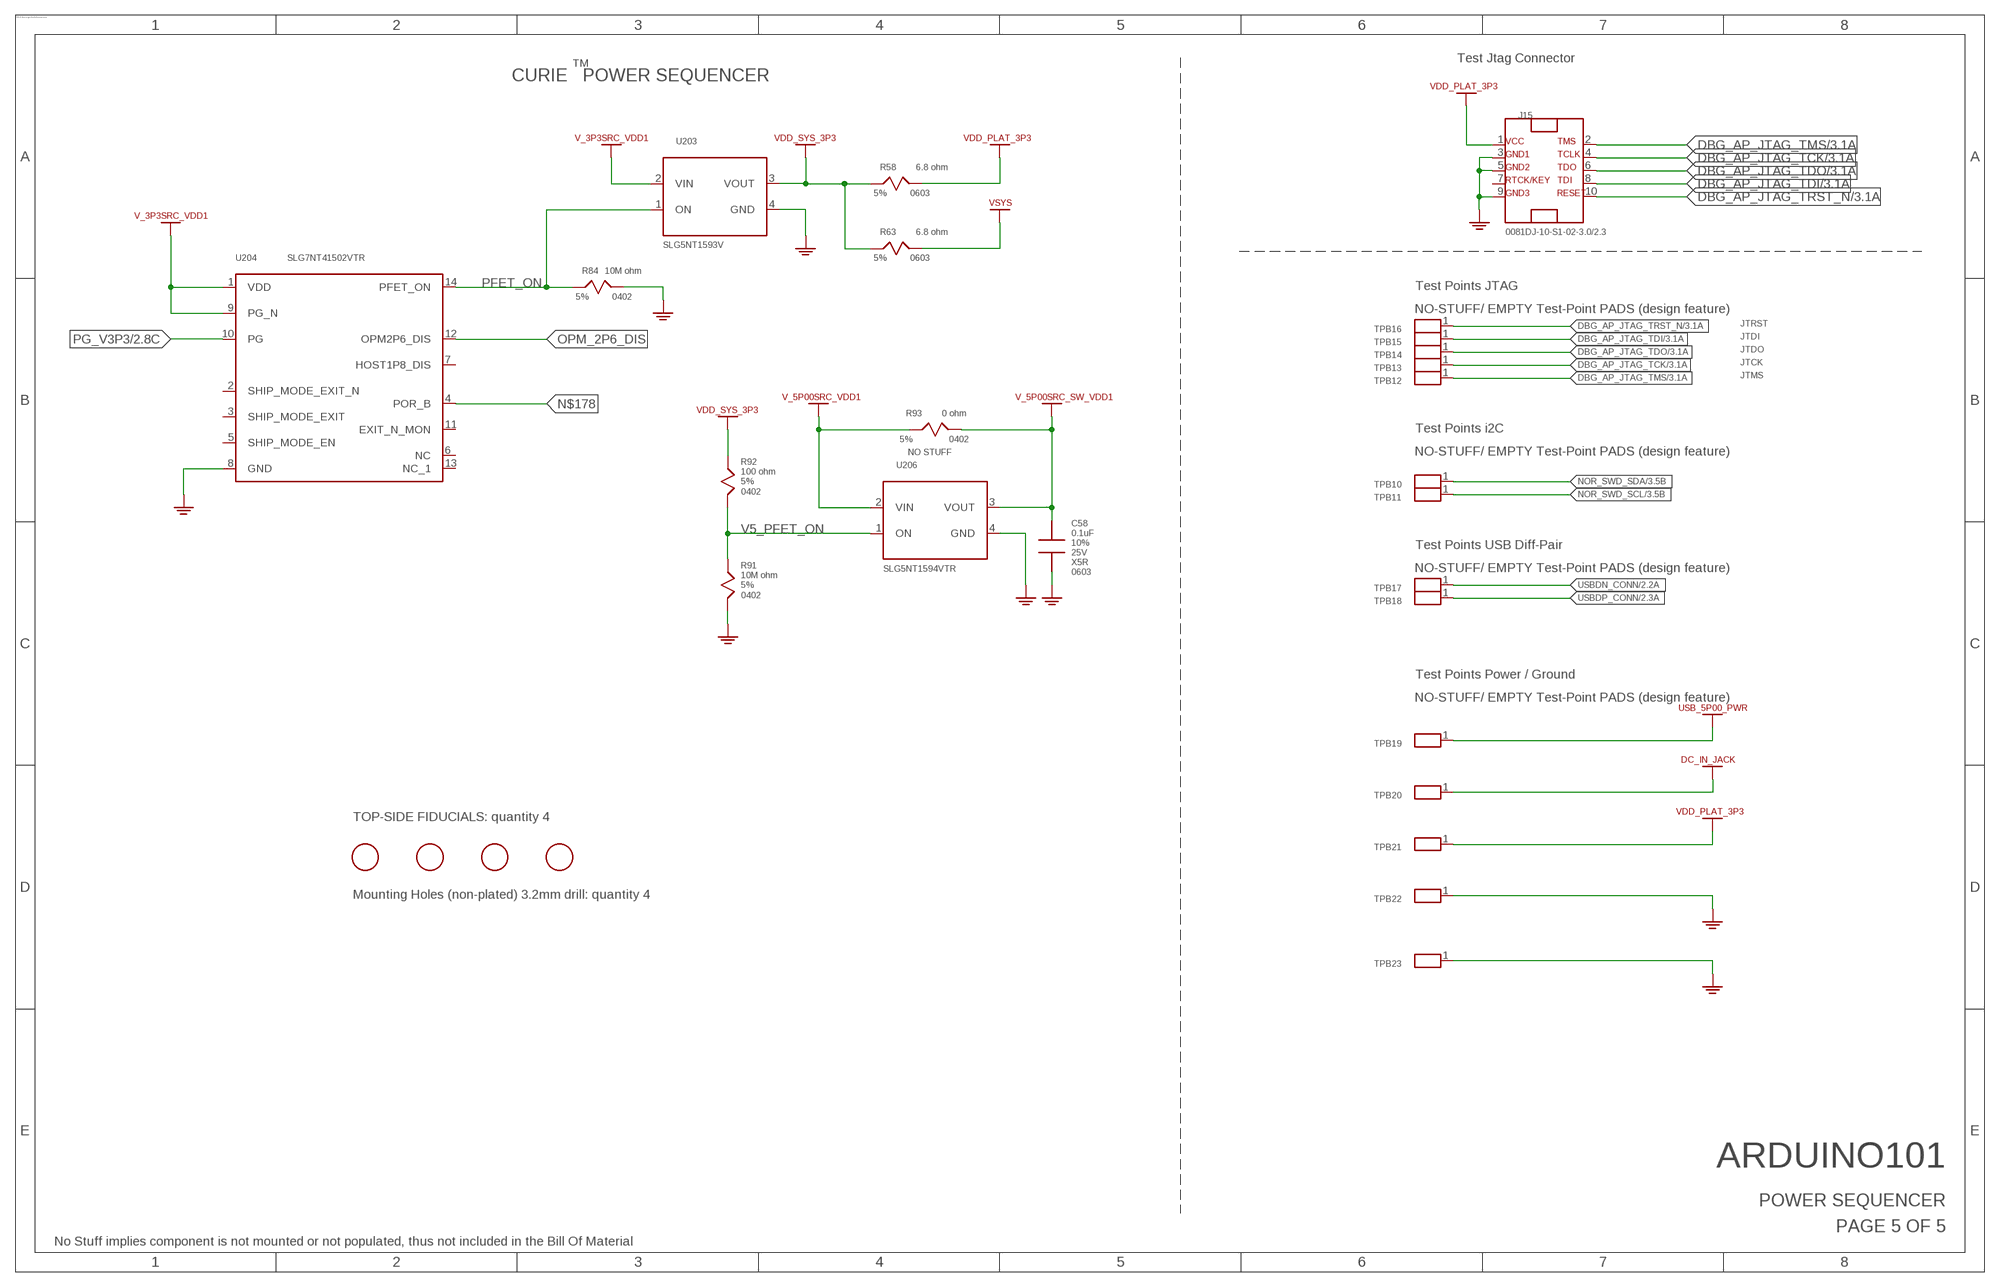
[diagram p5: schematic, sheet 5]

### Parts
C58  0.1uF  GRM188R61E104KA01  [0603X90H]
J15  CON_JTAG_20021111-00010T4LF  [CONM2X5-127P_1270X559X533H]
R58  6.8 ohm  CRCW06036R80JNEB  [0603X90H]
R63  6.8 ohm  CRCW06036R80JNEB  [0603X90H]
R84  10M ohm  RK73B1ETTP106J  [SMR0402]
R91  10M ohm  RK73B1ETTP106J  [SMR0402]
R92  100 ohm  CRCW0402100RJNED  [SMR0402]
R93  0 ohm  CRCW04020000Z0ED_NOSTUFF  [SMR0402]
TPB10  TESTPAD  [TP40]
TPB11  TESTPAD  [TP40]
TPB12  TESTPAD  [TP40]
TPB13  TESTPAD  [TP40]
TPB14  TESTPAD  [TP40]
TPB15  TESTPAD  [TP40]
TPB16  TESTPAD  [TP40]
TPB17  TESTPAD  [TP40]
TPB18  TESTPAD  [TP40]
TPB19  TESTPAD  [TP40]
TPB20  TESTPAD  [TP40]
TPB21  TESTPAD  [TP40]
TPB22  TESTPAD  [TP40]
TPB23  TESTPAD  [TP40]
U203  SLG5NT1593V  [LCC4_P4MM_SQ1MM]
U204  SLG7NT41502VTR  [STQFN14_2_40MA]
U206  SLG5NT15944V  [LCC4_P4MM_SQ1MM]
U$1  FIDUCIAL_40  [FIDUCIAL_40]
U$2  FIDUCIAL_40  [FIDUCIAL_40]
U$3  FIDUCIAL_40  [FIDUCIAL_40]
U$4  FIDUCIAL_40  [FIDUCIAL_40]

### Nets
DBG_AP_JTAG_TCK: J15.4 TPB13.1 ; also sheet 3
DBG_AP_JTAG_TDI: J15.8 TPB15.1 ; also sheet 3
DBG_AP_JTAG_TDO: J15.6 TPB14.1 ; also sheet 3
DBG_AP_JTAG_TMS: J15.2 TPB12.1 ; also sheet 3
DBG_AP_JTAG_TRST_N: J15.10 TPB16.1 ; also sheet 3
DC_IN_JACK: TPB20.1 ; also sheet 2
GND [PWR]: C58.2 J15.3 J15.5 J15.9 R84.2 R91.2 TPB22.1 TPB23.1 U203.4(GND) U204.8(GND) U206.4(GND) ; also sheet 2,3,4
N$178: U204.4(POR_B) ; also sheet 3
N$309: R58.1 R63.1 R92.1 U203.3(VOUT) ; supply symbol labelled VDD_SYS_3P3
NOR_SWD_SCL: TPB11.1 ; also sheet 3
NOR_SWD_SDA: TPB10.1 ; also sheet 3
OPM_2P6_DIS: U204.12(OPM2P6_DIS) ; also sheet 3
PFET_ON: R84.1 U203.1(ON) U204.14(PFET_ON)
PG_V3P3: U204.10(PG) ; also sheet 2
USB_5P00_PWR [PWR]: TPB19.1 ; also sheet 2
USBDN_CONN [DIFF100]: TPB17.1 ; also sheet 2,3
USBDP_CONN: TPB18.1 ; also sheet 2,3
V5_PFET_ON: R91.1 R92.2 U206.1(ON)
V_3P3SRC_VDD1 [PWR]: U203.2(VIN) U204.1(VDD) U204.9(PG_N) ; also sheet 2
V_5P00SRC_SW_VDD1: C58.1 R93.2 U206.3(VOUT) ; also sheet 2,4
V_5P00SRC_VDD1 [PWR]: R93.1 U206.2(VIN) ; also sheet 2
VDD_PLAT_3P3 [PWR]: J15.1 R58.2 TPB21.1 ; also sheet 2,3,4
VSYS [PWR]: R63.2 ; also sheet 3
Unconnected: J15.7 U204.2(SHIP_MODE_EXIT_N) U204.3(SHIP_MODE_EXIT) U204.5(SHIP_MODE_EN) U204.6(NC) U204.7(HOST1P8_DIS) U204.11(EXIT_N_MON) U204.13(NC_1) U$1.1 U$2.1 U$3.1 U$4.1

### Notes on the sheet
- C:/SPB_Data/eagle/TinyTILE/header.bmp
- Test Jtag Connector
- TM
- CURIE   POWER SEQUENCER
- Test Points JTAG
- NO-STUFF/ EMPTY Test-Point PADS (design feature)
- JTRST
- JTDI
- JTDO
- JTCK
- JTMS
- Test Points i2C
- NO-STUFF/ EMPTY Test-Point PADS (design feature)
- Test Points USB Diff-Pair
- NO-STUFF/ EMPTY Test-Point PADS (design feature)
- Test Points Power / Ground
- NO-STUFF/ EMPTY Test-Point PADS (design feature)
- TOP-SIDE FIDUCIALS: quantity 4
- Mounting Holes (non-plated) 3.2mm drill: quantity 4
- ARDUINO101
- POWER SEQUENCER
- PAGE 5 OF 5
- No Stuff implies component is not mounted or not populated, thus not included in the Bill Of Material

## Library data of the parts
C1 = ard101:CC0603CRNPO9BN1R2: 1.2pF 0603 50V C0G +/-0.25pF; COEF: C0G; MANUFACTURER: YAGEO; PN: CC0603CRNPO9BN1R2; SIZE: 0603; TOL: 0.25pF; VOLTAGE: 50V
C2 C38 C46 C47 = ard101:GRM188R61E104KA01_NOSTUFF: 0.1uF 0603 25V X5R 10% NO-STUFF/EMPTY; COEF: X5R; MANUFACTURER: MURATA; PN: GRM188R61E104KA01; SIZE: 0603; STUFF: NO STUFF; TOL: 10%; VOLTAGE: 25V
C3 = ard101:GRM1885C1H100JA01F: 10pF 0603 50V C0G 5%; COEF: C0G; MANUFACTURER: MURATA; PN: GRM1885C1H100JA01F; SIZE: 0603; TOL: 5%; VOLTAGE: 50V
C11 C21 C25 C29 C31 C33 = ard101:GRM188R61C475KAAJD: 4.7uF 0603 16V X5R 20%; COEF: X5R; MANUFACTURER: MURATA; PN: GRM188R61C475KAAJD; SIZE: 0603; TOL: 20%; VOLTAGE: 16V
C12 C16-C18 C42 C50 = ard101:GRM188R6YA475KE15D: 4.7uF 0603 35V X5R 10%; COEF: X5R; MANUFACTURER: MURATA; PN: GRM188R6YA475KE15D; SIZE: 0603; TOL: 10%; VOLTAGE: 35V
C13 C20 C23 C49 = ard101:GRM188R61E106MA73D: 10uF 0603 25V X5R 20%; COEF: X5R; MANUFACTURER: MURATA; PN: GRM188R61E106MA73D; SIZE: 0603; TOL: 20%; VOLTAGE: 25V
C14 = ard101:GRM188R61A226ME15D: 22uF 0603 10V X5R 20%; COEF: X5R; MANUFACTURER: MURATA; PN: GRM188R61A226ME15D; SIZE: 0603; TOL: 20%; VOLTAGE: 10V
C15 = ard101:GRM188R71H333KA61F: 0.033uF 0603 50V X7R 10%; COEF: X7R; MANUFACTURER: MURATA; PN: GRM188R71H333KA61F; SIZE: 0603; TOL: 10%; VOLTAGE: 50V
C19 C41 = ard101:GRM1885C1H330JA01F: 33pF 0603 50V C0G 5%; COEF: C0G; MANUFACTURER: MURATA; PN: GRM1885C1H330JA01F; SIZE: 0603; TOL: 5%; VOLTAGE: 50V
C22 C24 C26 C28 C30 C32 C35 C36 C39 C43-C45 C48 C51-C55 C58 = ard101:GRM188R61E104KA01: 0.1uF 0603 25V X5R 10%; COEF: X5R; MANUFACTURER: MURATA; PN: GRM188R61E104KA01; SIZE: 0603; TOL: 10%; VOLTAGE: 25V
C56 = ard101:GRM155R60J226ME11D: 22uF 0402 6.3V X5R 20%; COEF: X5R; MANUFACTURER: MURATA; PN: GRM155R60J226ME11D; SIZE: 0402; TOL: 20%; VOLTAGE: 6.3V
C57 = ard101:GRM033R60J104KE81D: 0.1uF 0201 6.3V X5R 10%; COEF: X5R; MANUFACTURER: MURATA; PN: GRM033R60J104KE81D; SIZE: 0201; TOL: 10%; VOLTAGE: 6.3V
D10 D13 D14 = ard101:LED_SML-P12PTT86: LED EIA 1005 (0402) SMD GREEN vertical; COLOR: GREEN; MANUFACTURER: ROHM; PN: SML-P12PTT86; SIZE: 0402
D15 = ard101:LED_SML-P11UTT86: LED RED 54MW 20MA 0402 SMD; COLOR: RED; MANUFACTURER: ROHM; PN: SML-P11UTT86; SIZE: 0402
D17 D18 = ard101:DIO_RSX501L-20TE25: SHTKY DIODE SOD106 20V 5Amp 5.0x2.6x2.0 nominal; MANUFACTURER: ROHM CO; PN: RSX501L-20TE25
ESD10 ESD11 = ard101:PESD5V0X1BCAL,315: TVS DIODE 5.5VWM 17VC SOD882; MANUFACTURER: NXP Semiconductors; PN: PESD5V0X1BCAL,315; SIZE: SOD882
FB1 = ard101:FERRITE_BEAD_0603_BLM18KG331SN1D: FER-BEAD 0603 330 ohm 1.7A 25%; CURRENT: 1.7 amp; IMPEDANCE: 330 ohm; MANUFACTURER: MURATA; PN: BLM18KG331SN1D; SIZE: 0603; TOL: 25%
J10 = ard101:CON_1X8_2211-08-S-02-3.2: CONNECTOR HEADER 1X8 RECEPTACLE VERTICAL 2.54mm Pitch THMNT; MANUFACTURER: SINGATRON; PN: 2211-08-S-02-3.2
J11 = ard101:CON_1X10_2211-10-S-02: CONNECTOR / HEADER 1X10 PLUG VERTICAL 2.54mm pitch; MANUFACTURER: SINGATRON; PN: 2211-10-S-02
J12 = ard101:CON_2X3_2202-06-S-02-6.0: CONNECTOR HEADER 2X3 PLUG VERTICAL 2.54mm pitch; MANUFACTURER: SINGATRON; PN: 2202-06-S-02-6.0/3.0
J13 = ard101:CON_1X8_2211-08-S-02-3.2_IO: IO CONNECTOR HEADER 1X8 RECEPTACLE VERTICAL 2.54mm Pitch THMNT; MANUFACTURER: SINGATRON; PN: 2211-08-S-02-3.2
J14 = ard101:CON_1X6_2211-06-S-02-3.2: CONNECTOR / HEADER 1X6 RECEPTACLE VERTICAL 2.54mm pitch; MANUFACTURER: SINGATRON; PN: 2211-06-S-02-3.2
J15 = ard101:CON_JTAG_20021111-00010T4LF: JTAG CONN/HDR 2X5 PLUG VERTICAL 1.27MM pitch; MANUFACTURER: SINGATRON; PN: 0081DJ-10-S1-02-3.0/2.3
J16 = ard101:CON_DC_PWR_JACK: 3-pin DC PWR JACK; MANUFACTURER: SINGATRON; PN: 2DC-0005D200
J17 = ard101:CON_USB_TYPE_B: 4P USB TYPE B RA connector, 2 MTG pads; MANUFACTURER: SINGATRON; PN: 2KS-001BNW0L
J18 = ard101:20449-001E-01: Ultra Miniature Coaxial, IPEX MHF4 Connector Receptacle, Male Pin 50 Ohm Surface Mount Solder; MANUFACTURER: TAOGLAS LIMITED; PN: RECE-20449-001E-01; STUFF: NO STUFF
L1 = ard101:IND_LQG18HN4N7S00D: INDCTOR MTILAYER 4.7 nH 300mA 0603 10%; MANUFACTURER: MURATA; PN: LQG18HN4N7S00D; TOL: 10%
L10 L14 = ard101:IND_DFE201610P-2R2M=P2: 0806 2-pin inductor WWOUND 2.2uH 2A 20% PKG 2016; MANUFACTURER: MURATA; PN: DFE201610P-2R2M=P2; TOL: 20%
L12 = ard101:NRH3012T220MN: 22µH Shielded Wirewound Inductor 500mA 756 mOhm Max Nonstandard; MANUFACTURER: TAIYO YUDEN; PN: NRH3012T220MN; TOL: 20%
R10 R15 R16 = ard101:RK73B1JTTD331J: 330 ohm 5% 1/10W 0603; MANUFACTURER: KOA SPEER; PN: RK73B1JTTD331J; SIZE: 0603; TOL: 5%
R12 R31 R32 R35 = ard101:CRCW060322R0FKEA: 22 ohm 1% 1/10W 0603; MANUFACTURER: VISHAY-DALE; PN: CRCW060322R0FKEA; SIZE: 0603; TOL: 1%
R13 R23 = ard101:RK73H1JTTD1000F: 100 ohm 1% 1/10W 0603; MANUFACTURER: KOA SPEER; PN: RK73H1JTTD1000F; SIZE: 0603; TOL: 1%
R14 R75 = ard101:RK73H1JTTD1001F: 1K ohm 1% 1/10W 0603; MANUFACTURER: KOA SPEER; PN: RK73H1JTTD1001F; SIZE: 0603; TOL: 1%
R18 R24 = ard101:CRCW06030000Z0EA_NOSTUFF: 0 ohm 5% 1/10W 0603 NO-STUFF/EMPTY; MANUFACTURER: VISHAY-DALE; PN: CRCW06030000Z0EA; SIZE: 0603; STUFF: NO STUFF; TOL: 5%
R19 R59 = ard101:CRCW06030000Z0EA: 0 ohm 5% 1/10W 0603; MANUFACTURER: VISHAY-DALE; PN: CRCW06030000Z0EA; SIZE: 0603; TOL: 5%
R27-R29 R65 = ard101:CRCW0603200KJNEB: 200K ohm 5% 1/10W 0603; MANUFACTURER: VISHAY-DALE; PN: CRCW0603200KJNEB; SIZE: 0603; TOL: 5%
R30 R33 R57 R62 R70 R77 R82 = ard101:CRCW060310K0FKEA: 10K ohm 1% 1/10W 0603; MANUFACTURER: VISHAY-DALE; PN: CRCW060310K0FKEA; SIZE: 0603; TOL: 1%
R34 = ard101:CRCW06031K80FKEBC: 1.8K ohm 1% 1/10W 0603; MANUFACTURER: VISHAY-DALE; PN: CRCW06031K80FKEBC; SIZE: 0603; TOL: 1%
R58 R63 = ard101:CRCW06036R80JNEB: 6.8 ohm 5% 1/10W 0603; MANUFACTURER: VISHAY-DALE; PN: CRCW06036R80JNEB; SIZE: 0603; TOL: 5%
R71 = ard101:CRCW060310K0FKEA_NOSTUFF: 10K ohm 1% 1/10W 0603 NO-STUFF/EMPTY; MANUFACTURER: VISHAY-DALE; PN: CRCW060310K0FKEA; SIZE: 0603; STUFF: NO STUFF; TOL: 1%
R73 = ard101:CRCW0603402RFKEB: 402 ohm 1% 1/10W 0603; MANUFACTURER: VISHAY-DALE; PN: CRCW0603402RFKEB; SIZE: 0603; TOL: 1%
R74 = ard101:CRCW0603698RFKEB: 698 ohm 1% 1/10W 0603; MANUFACTURER: VISHAY-DALE; PN: CRCW0603698RFKEB; SIZE: 0603; TOL: 1%
R81 = ard101:RK73H1JTTD3001F: Resistor - SMD 3K ohm 1% 1/10 watt 0603; MANUFACTURER: KOA SPEER; PN: RK73H1JTTD3001F; SIZE: 0603; TOL: 1%
R83 = ard101:CRCW06031K50FKEB: 1.5K ohm 1% 1/10W 0603; MANUFACTURER: VISHAY-DALE; PN: CRCW06031K50FKEB; SIZE: 0603; TOL: 1%
R84 R86 R91 = ard101:RK73B1ETTP106J: 10M ohm 5% 1/16W 0402; MANUFACTURER: KOA SPEER; PN: RK73B1ETTP106J; SIZE: 0402; TOL: 5%
R88 = ard101:RK73H1ETTP2800F: 0402 Thick Film Resistors - SMD 1/16watts 280ohms 1%; MANUFACTURER: KOA SPEER; PN: RK73H1ETTP2800F; SIZE: 0402; TOL: 1%
R89 R92 = ard101:CRCW0402100RJNED: 100 ohm 5% 1/16W 0402; MANUFACTURER: VISHAY-DALE; PN: CRCW0402100RJNED; SIZE: 0402; TOL: 5%
R90 = ard101:RK73B1ETTP104J: 100K ohm 5% 1/16W 0402; MANUFACTURER: KOA SPEER; PN: RK73B1ETTP104J; SIZE: 0402; TOL: 5%
R93 = ard101:CRCW04020000Z0ED_NOSTUFF: 0 ohm 5% 1/16W 0402 NO-STUFF/EMPTY; MANUFACTURER: VISHAY-DALE; PN: CRCW04020000Z0ED; SIZE: 0402; STUFF: NO STUFF; TOL: 5%
SH10 = ard101:SHORTING_PAD_2_SHORT_140X180_SH: embedded PCB feature: Shorting Pad with 0.2MM airgap; MANUFACTURER: PCB; PN: PCB feature; SIZE: 1.38 x 1.78 MM; STUFF: NO STUFF; TOL: 0.2MM airgap
SW10 SW12 = ard101:SWITCH_PTS645-S-M-43-SMTR92-LFS: SWITCH TACTILE VERTICAL SMT SPST 12V; MANUFACTURER: C&K COMPONENTS; PN: PTS645-S-M-43-SMTR92-LFS
TPB10-TPB23 = ard101:TESTPAD: TESTPAD
U10 = ard101:TPS62153RGTR: 16-pin with Exposed Pad (center Die Flag) QFN,TPS62153; MANUFACTURER: TEXAS INSTRUMENTS; PN: TPS62153RGTR
U11 U14 U15 = ard101:IC_LSF0108PWR: LSF0108PWR SOIC 20-pin MULTI-VOLTAGE LEVELTRANSLATOR; MANUFACTURER: TEXAS INSTRUMENTS; PN: LSF0108PWR
U12 = tinyTILE:CURIE: CURIE; PN: CURIE
U13 = ard101:FPF2496UCX_WLCSP_VREG: 9-bump WLCSP FPF2496UCX VREG; MANUFACTURER: FAIRCHILD SEMI; PN: FPF2496UCX
U16 = ard101:SN74AUP1G34DBVR: SOT23 5-pin BUFFER/DRIVER SN74AUP1G34; MANUFACTURER: TEXAS INSTRUMENTS; PN: SN74AUP1G34DBVR
U201 = ard101:IC_MX25V1635FM2I_FLASH: SERIAL_NORFLASH SPI 16MBIT 2.7V SOIC-W; MANUFACTURER: MACRONIX; PN: MX25L1606EM2I-12G
U202 = ard101:R3119-VREG: SOT23-5_160X290X120H VREG; MANUFACTURER: RICOH; PN: R3119N050A-TR-FE
U203 = ard101:SLG5NT1593V: REGULATOR; PN: SLG5NT1593V
U204 = ard101:SLG7NT41502VTR: INTERFACE 14-pin QFN SLG7NT41502VTR; MANUFACTURER: SILEGO; PN: SLG7NT41502VTR
U205 = ard101:TPS62162DSG: DFN TPS62162,VREG DC/DC; MANUFACTURER: TEXAS INSTRUMENTS; PN: TPS62162DSG
U206 = ard101:SLG5NT15944V: ANALOGSWITCH 4-pin TDFN SLG5NT1594; MANUFACTURER: SILEGO; PN: SLG5NT1594VTR
U$1-U$4 = ard101:FIDUCIAL_40: 1mm Fiducial

## Net classes
0 default: width 0.102 mm, drill 0.203 mm
1 RF: width 0.178 mm, drill 0.203 mm
2 PWR: width 0.508 mm, drill 0.203 mm
3 DIFF100: width 0.102 mm, drill 0.203 mm, clearance 0.157 mm